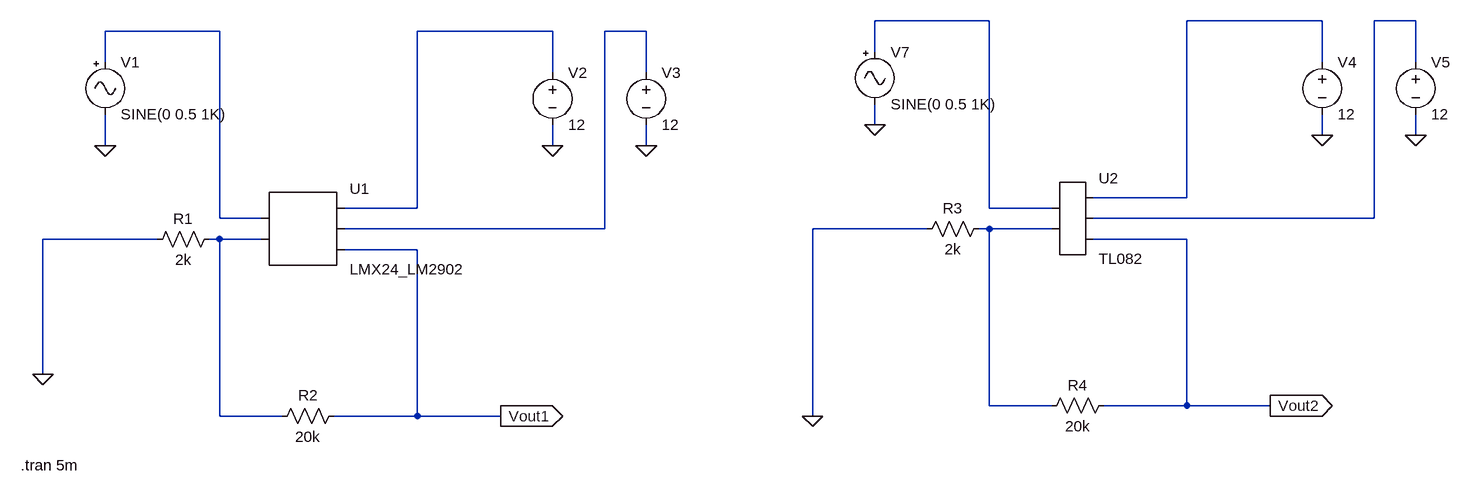
[diagram p0: schematic SimulacaoRelatorio1Parte3.asc]
SimulacaoRelatorio1Parte3.asc, the LTspice schematic file:
Version 4
SHEET 1 2696 716
WIRE 1984 16 1808 16
WIRE 2496 16 2288 16
WIRE 2640 16 2576 16
WIRE 800 32 624 32
WIRE 1312 32 1104 32
WIRE 1456 32 1392 32
WIRE 1808 64 1808 16
WIRE 624 80 624 32
WIRE 2496 80 2496 16
WIRE 2640 80 2640 16
WIRE 1312 96 1312 32
WIRE 1456 96 1456 32
WIRE 1808 176 1808 144
WIRE 2496 192 2496 160
WIRE 2640 192 2640 160
WIRE 624 208 624 160
WIRE 1312 208 1312 176
WIRE 1456 208 1456 176
WIRE 2288 288 2288 16
WIRE 2288 288 2144 288
WIRE 1104 304 1104 32
WIRE 1104 304 992 304
WIRE 1984 304 1984 16
WIRE 2080 304 1984 304
WIRE 800 320 800 32
WIRE 864 320 800 320
WIRE 2576 320 2576 16
WIRE 2576 320 2144 320
WIRE 1392 336 1392 32
WIRE 1392 336 992 336
WIRE 1888 336 1712 336
WIRE 1984 336 1968 336
WIRE 2080 336 1984 336
WIRE 704 352 528 352
WIRE 800 352 784 352
WIRE 864 352 800 352
WIRE 2288 352 2144 352
WIRE 1104 368 992 368
WIRE 528 560 528 352
WIRE 1984 608 1984 336
WIRE 2080 608 1984 608
WIRE 2288 608 2288 352
WIRE 2288 608 2160 608
WIRE 2416 608 2288 608
WIRE 800 624 800 352
WIRE 896 624 800 624
WIRE 1104 624 1104 368
WIRE 1104 624 976 624
WIRE 1232 624 1104 624
WIRE 1712 624 1712 336
FLAG 528 560 0
FLAG 1232 624 Vout1
IOPIN 1232 624 Out
FLAG 1312 208 0
FLAG 1456 208 0
FLAG 1712 624 0
FLAG 2416 608 Vout2
IOPIN 2416 608 Out
FLAG 2496 192 0
FLAG 2640 192 0
FLAG 624 208 0
FLAG 1808 176 0
SYMBOL AutoGenerated\\LMX24_LM2902 928 336 R0
SYMATTR InstName U1
SYMBOL res 992 608 R90
WINDOW 0 0 56 VBottom 2
WINDOW 3 32 56 VTop 2
SYMATTR InstName R2
SYMATTR Value 20k
SYMBOL res 800 336 R90
WINDOW 0 0 56 VBottom 2
WINDOW 3 32 56 VTop 2
SYMATTR InstName R1
SYMATTR Value 2k
SYMBOL voltage 1312 80 R0
SYMATTR InstName V2
SYMATTR Value 12
SYMBOL voltage 1456 80 R0
SYMATTR InstName V3
SYMATTR Value 12
SYMBOL res 2176 592 R90
WINDOW 0 0 56 VBottom 2
WINDOW 3 32 56 VTop 2
SYMATTR InstName R4
SYMATTR Value 20k
SYMBOL res 1984 320 R90
WINDOW 0 0 56 VBottom 2
WINDOW 3 32 56 VTop 2
SYMATTR InstName R3
SYMATTR Value 2k
SYMBOL voltage 2496 64 R0
SYMATTR InstName V4
SYMATTR Value 12
SYMBOL voltage 2640 64 R0
SYMATTR InstName V5
SYMATTR Value 12
SYMBOL AutoGenerated\\TL082 2112 320 R0
SYMATTR InstName U2
SYMBOL Misc\\signal 624 64 R0
SYMATTR InstName V1
SYMATTR Value SINE(0 0.5 1K)
SYMBOL Misc\\signal 1808 48 R0
SYMATTR InstName V7
SYMATTR Value SINE(0 0.5 1K)
TEXT 494 700 Left 2 !.tran 5m

The netlist it stands for:
* SimulacaoRelatorio1Parte3.asc
* U1: LMX24_LM2902 (symbol AutoGenerated\LMX24_LM2902 not available, pins judged from their places): pin1=N004 pin2=N008 pin3=N005 pin4=N006 pin5=Vout1
R2 Vout1 N008 20k
R1 N008 0 2k
V2 N005 0 12
V3 N006 0 12
R4 Vout2 N007 20k
R3 N007 0 2k
V4 N002 0 12
V5 N003 0 12
* U2: TL082 (symbol AutoGenerated\TL082 not available, pins judged from their places): pin1=N001 pin2=N007 pin3=N002 pin4=N003 pin5=Vout2
V1 N004 0 SINE(0 0.5 1K)
V7 N001 0 SINE(0 0.5 1K)
.tran 5m
.backanno
.end